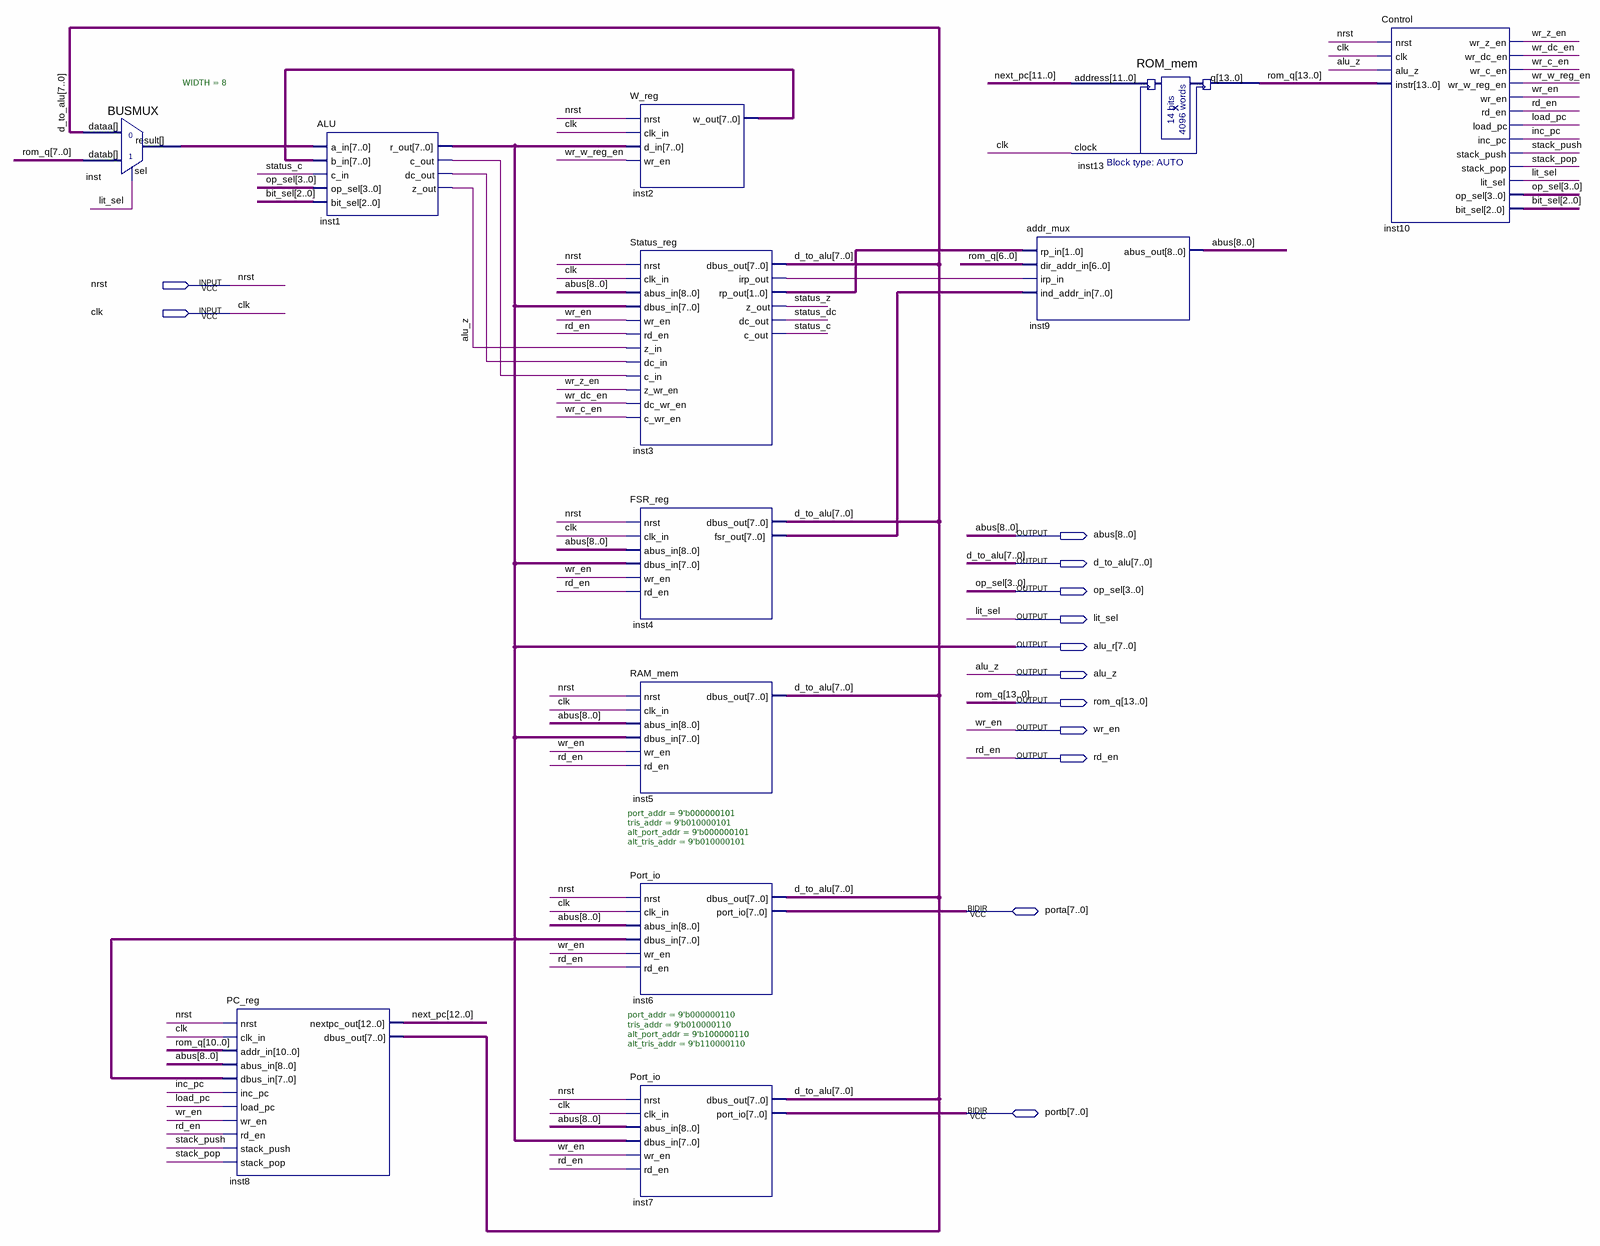
[diagram p0: schematic sheet]
// Quartus schematic PIC16F648A.bdf as structural Verilog: 12 symbols, 13 pins
module PIC16F648A (
  input  nrst,
  input  clk,
  inout  [7:0] porta,
  inout  [7:0] portb,
  output [8:0] abus,
  output [7:0] d_to_alu,
  output [3:0] op_sel,
  output lit_sel,
  output [7:0] alu_r,
  output alu_z,
  output [13:0] rom_q,
  output wr_en,
  output rd_en
);

  wire inc_pc, inst1_c_out, inst1_dc_out, inst3_irp_out, load_pc, stack_pop, stack_push, status_c, status_dc,
       status_z, wr_c_en, wr_dc_en, wr_w_reg_en, wr_z_en;
  wire [1:0] inst3_rp_out;
  wire [2:0] bit_sel;
  wire [7:0] inst2_w_out, inst4_fsr_out, inst_result;
  wire [12:0] next_pc;

  BUSMUX #(.WIDTH(8)) inst (.sel(lit_sel), .dataa(d_to_alu), .datab(rom_q[7:0]), .result(inst_result));
  PC_reg inst8 (
    .nrst(nrst), .clk_in(clk), .addr_in(rom_q[10:0]), .abus_in(abus), .dbus_in(alu_r), .inc_pc(inc_pc),
    .load_pc(load_pc), .wr_en(wr_en), .rd_en(rd_en), .stack_push(stack_push), .stack_pop(stack_pop),
    .nextpc_out(next_pc), .dbus_out(d_to_alu));
  ALU inst1 (
    .a_in(inst_result), .b_in(inst2_w_out), .c_in(status_c), .op_sel(op_sel), .bit_sel(bit_sel),
    .r_out(alu_r), .c_out(inst1_c_out), .dc_out(inst1_dc_out), .z_out(alu_z));
  W_reg inst2 (.nrst(nrst), .clk_in(clk), .d_in(alu_r), .wr_en(wr_w_reg_en), .w_out(inst2_w_out));
  Status_reg inst3 (
    .nrst(nrst), .clk_in(clk), .abus_in(abus), .dbus_in(alu_r), .wr_en(wr_en), .rd_en(rd_en), .z_in(alu_z),
    .dc_in(inst1_dc_out), .c_in(inst1_c_out), .z_wr_en(wr_z_en), .dc_wr_en(wr_dc_en), .c_wr_en(wr_c_en),
    .dbus_out(d_to_alu), .irp_out(inst3_irp_out), .rp_out(inst3_rp_out), .z_out(status_z),
    .dc_out(status_dc), .c_out(status_c));
  FSR_reg inst4 (
    .nrst(nrst), .clk_in(clk), .abus_in(abus), .dbus_in(alu_r), .wr_en(wr_en), .rd_en(rd_en),
    .dbus_out(d_to_alu), .fsr_out(inst4_fsr_out));
  RAM_mem inst5 (
    .nrst(nrst), .clk_in(clk), .abus_in(abus), .dbus_in(alu_r), .wr_en(wr_en), .rd_en(rd_en),
    .dbus_out(d_to_alu));
  Port_io #(.port_addr(9'b000000101), .tris_addr(9'b010000101), .alt_port_addr(9'b000000101), .alt_tris_addr(9'b010000101)) inst6 (
    .nrst(nrst), .clk_in(clk), .abus_in(abus), .dbus_in(alu_r), .wr_en(wr_en), .rd_en(rd_en),
    .dbus_out(d_to_alu), .port_io(porta));
  Port_io #(.port_addr(9'b000000110), .tris_addr(9'b010000110), .alt_port_addr(9'b100000110), .alt_tris_addr(9'b110000110)) inst7 (
    .nrst(nrst), .clk_in(clk), .abus_in(abus), .dbus_in(alu_r), .wr_en(wr_en), .rd_en(rd_en),
    .dbus_out(d_to_alu), .port_io(portb));
  addr_mux inst9 (
    .rp_in(inst3_rp_out), .irp_in(inst3_irp_out), .ind_addr_in(inst4_fsr_out), .dir_addr_in(rom_q[6:0]),
    .abus_out(abus));
  ROM_mem inst13 (.address(next_pc[11:0]), .clock(clk), .q(rom_q));
  Control inst10 (
    .nrst(nrst), .clk(clk), .alu_z(alu_z), .instr(rom_q), .wr_z_en(wr_z_en), .wr_dc_en(wr_dc_en),
    .wr_c_en(wr_c_en), .wr_w_reg_en(wr_w_reg_en), .wr_en(wr_en), .rd_en(rd_en), .load_pc(load_pc),
    .inc_pc(inc_pc), .stack_push(stack_push), .stack_pop(stack_pop), .lit_sel(lit_sel), .op_sel(op_sel),
    .bit_sel(bit_sel));
endmodule
